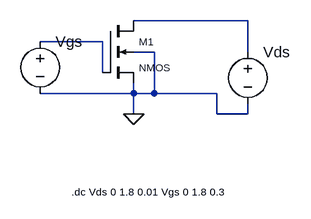
[diagram p0: schematic nmos.asc]
nmos.asc, the LTspice schematic file:
Version 4
SHEET 1 880 680
WIRE 336 128 160 128
WIRE 112 160 16 160
WIRE 192 176 160 176
WIRE 336 176 336 128
WIRE 112 208 112 160
WIRE 160 240 160 224
WIRE 160 240 16 240
WIRE 192 240 192 176
WIRE 192 240 160 240
WIRE 288 240 192 240
WIRE 160 272 160 240
WIRE 288 272 288 240
WIRE 336 272 336 256
WIRE 336 272 288 272
FLAG 160 272 0
SYMBOL nmos4 112 128 R0
WINDOW 0 56 32 Left 1
WINDOW 3 56 72 Left 1
SYMATTR InstName M1
SYMATTR Value2 l=0.18 w=0.27
SYMBOL voltage 16 144 R0
WINDOW 123 0 0 Left 0
WINDOW 39 0 0 Left 0
SYMATTR InstName Vgs
SYMATTR Value ""
SYMBOL voltage 336 160 R0
WINDOW 123 0 0 Left 0
WINDOW 39 0 0 Left 0
SYMATTR InstName Vds
SYMATTR Value ""
TEXT 64 392 Left 1 !.dc Vds 0 1.8 0.01 Vgs 0 1.8 0.3

The netlist it stands for:
* nmos.asc
M1 N001 N002 0 0 NMOS l=0.18 w=0.27
Vgs N002 0
Vds N001 0
.model NMOS NMOS
.model PMOS PMOS
.lib standard.mos
.dc Vds 0 1.8 0.01 Vgs 0 1.8 0.3
.backanno
.end